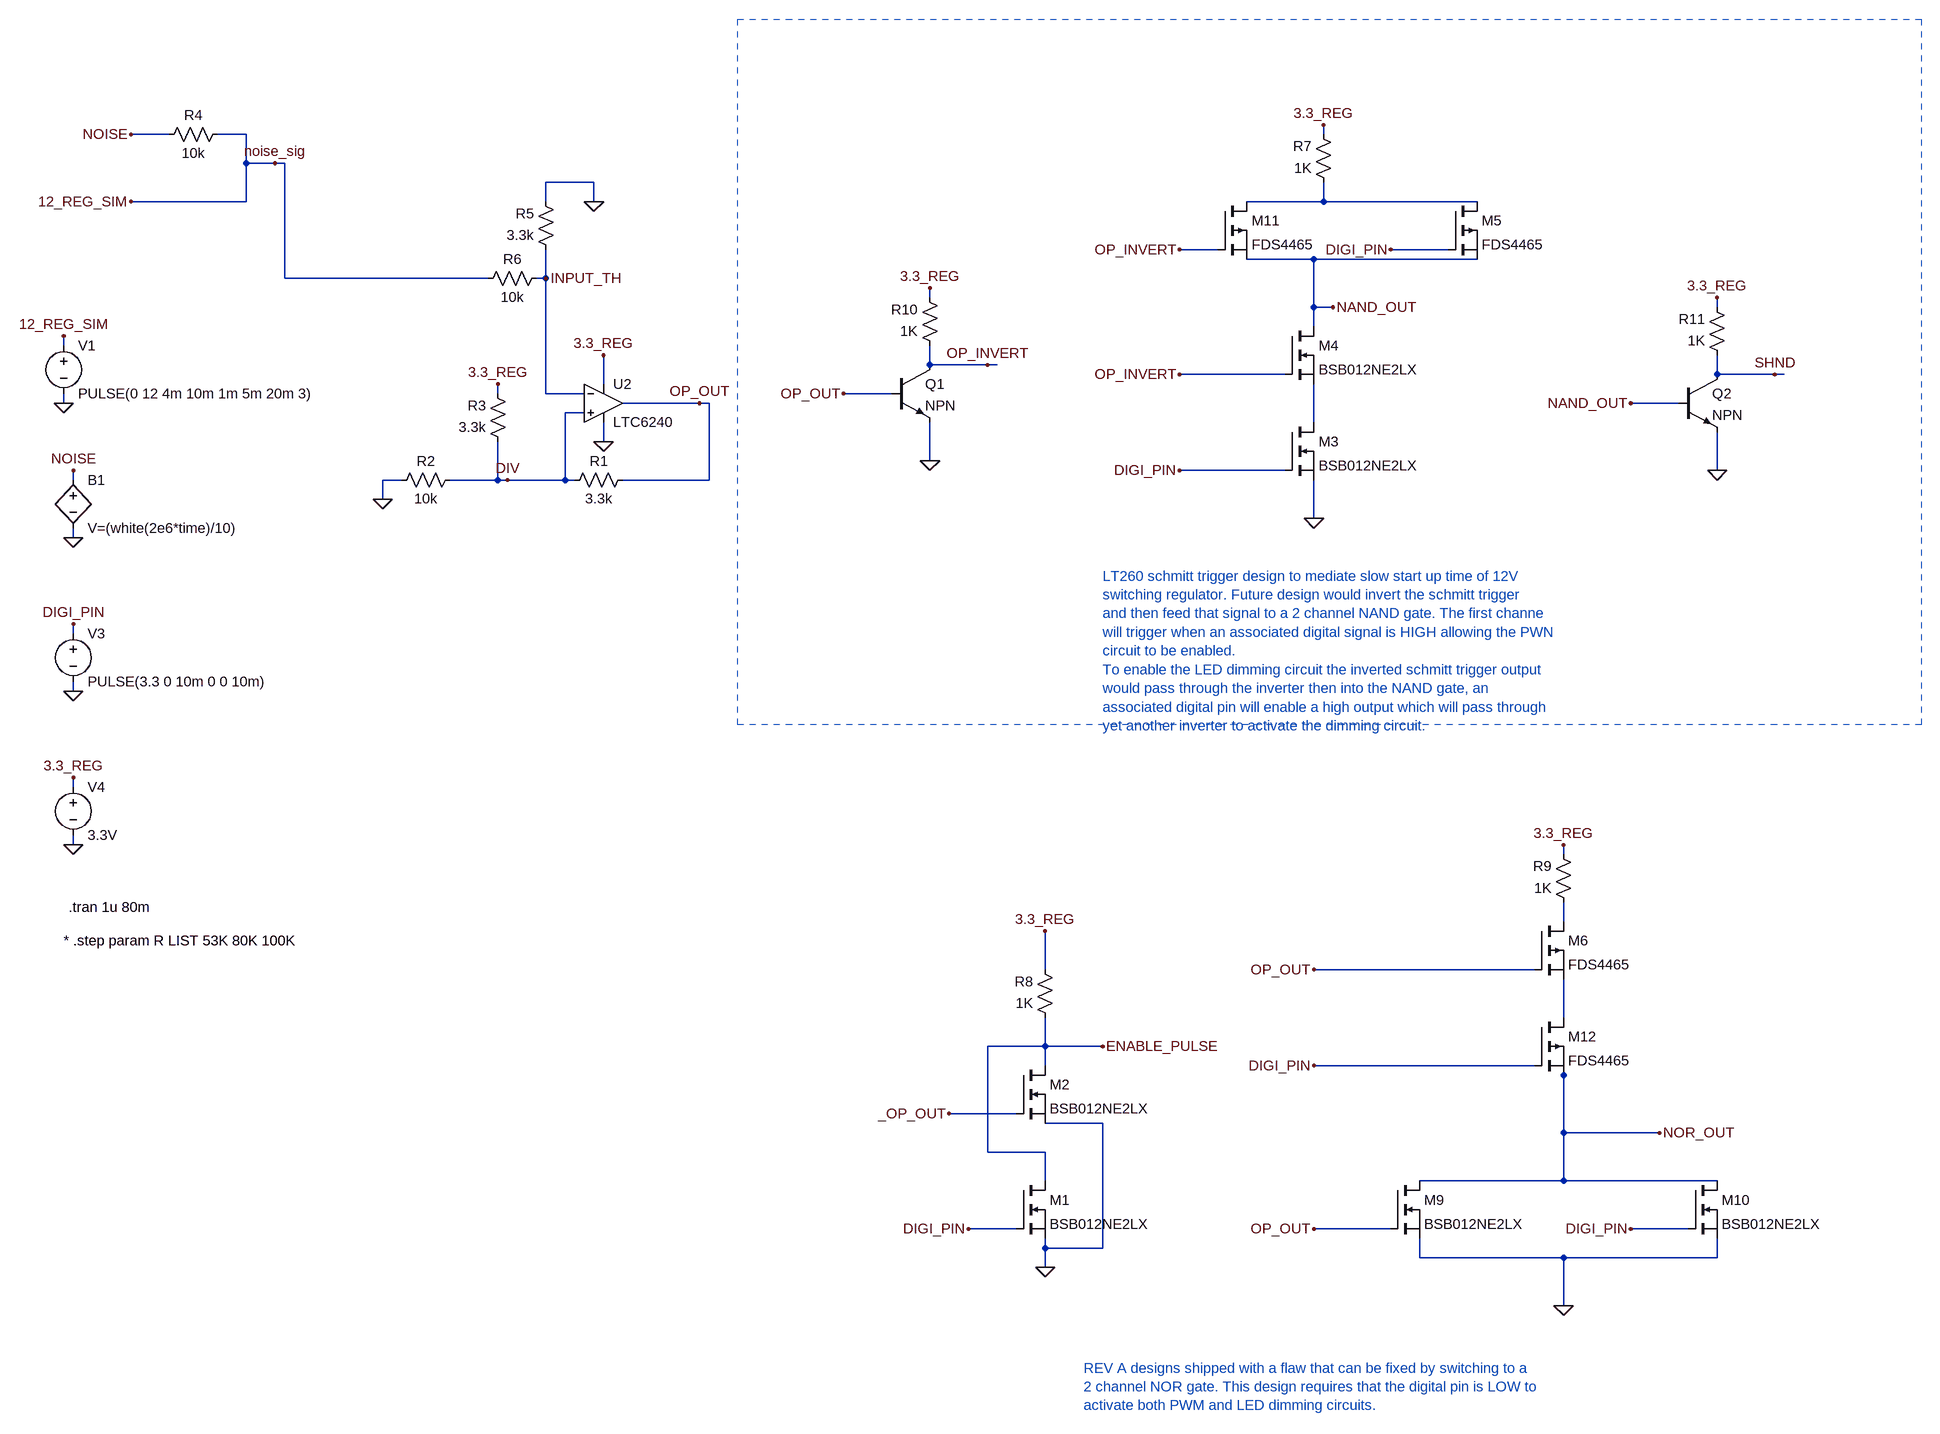
[diagram p0: schematic LT6240_positive_feedback.asc]
LT6240_positive_feedback.asc, the LTspice schematic file:
Version 4
SHEET 1 3400 2064
WIRE -208 -192 -272 -192
WIRE -80 -192 -128 -192
WIRE 1904 -192 1904 -208
WIRE -80 -144 -80 -192
WIRE -32 -144 -80 -144
WIRE -16 -144 -32 -144
WIRE 688 -112 608 -112
WIRE -80 -80 -80 -144
WIRE -80 -80 -272 -80
WIRE 608 -80 608 -112
WIRE 688 -80 688 -112
WIRE 1904 -80 1904 -112
WIRE 1904 -80 1776 -80
WIRE 2160 -80 1904 -80
WIRE 1728 0 1664 0
WIRE 2112 0 2016 0
WIRE 1888 16 1776 16
WIRE 2160 16 1888 16
WIRE -16 48 -16 -144
WIRE 512 48 -16 48
WIRE 608 48 608 0
WIRE 608 48 592 48
WIRE 1248 80 1248 64
WIRE 1888 96 1888 16
WIRE 1920 96 1888 96
WIRE 2560 96 2560 80
WIRE 1888 128 1888 96
WIRE -384 160 -384 144
WIRE 1248 192 1248 160
WIRE 1344 192 1248 192
WIRE 1360 192 1344 192
WIRE 1840 208 1664 208
WIRE 2560 208 2560 176
WIRE 2656 208 2560 208
WIRE 2672 208 2656 208
WIRE 704 224 704 176
WIRE 528 240 528 224
WIRE 608 240 608 48
WIRE 672 240 608 240
WIRE 1184 240 1104 240
WIRE -384 256 -384 240
WIRE 864 256 736 256
WIRE 880 256 864 256
WIRE 2496 256 2416 256
WIRE 672 272 640 272
WIRE 1888 288 1888 224
WIRE 704 320 704 288
WIRE 1248 352 1248 288
WIRE 1840 368 1664 368
WIRE 2560 368 2560 304
WIRE -368 384 -368 368
WIRE 368 384 336 384
WIRE 528 384 528 320
WIRE 528 384 448 384
WIRE 544 384 528 384
WIRE 640 384 640 272
WIRE 640 384 544 384
WIRE 656 384 640 384
WIRE 880 384 880 256
WIRE 880 384 736 384
WIRE 336 416 336 384
WIRE 1888 448 1888 384
WIRE -368 480 -368 464
WIRE -368 640 -368 624
WIRE -368 736 -368 720
WIRE -368 896 -368 880
WIRE -368 992 -368 976
WIRE 2304 1008 2304 992
WIRE 2304 1120 2304 1088
WIRE 1440 1200 1440 1136
WIRE 2256 1200 1888 1200
WIRE 2304 1280 2304 1216
WIRE 1440 1328 1440 1280
WIRE 1440 1328 1344 1328
WIRE 1536 1328 1440 1328
WIRE 1440 1360 1440 1328
WIRE 2256 1360 1888 1360
WIRE 2304 1376 2304 1360
WIRE 1392 1440 1280 1440
WIRE 1536 1456 1440 1456
WIRE 2304 1472 2304 1376
WIRE 2464 1472 2304 1472
WIRE 1344 1504 1344 1328
WIRE 1440 1504 1344 1504
WIRE 1440 1552 1440 1504
WIRE 2304 1552 2304 1472
WIRE 2304 1552 2064 1552
WIRE 2560 1552 2304 1552
WIRE 1392 1632 1312 1632
WIRE 2016 1632 1888 1632
WIRE 2512 1632 2416 1632
WIRE 1440 1664 1440 1648
WIRE 1536 1664 1536 1456
WIRE 1536 1664 1440 1664
WIRE 2064 1680 2064 1648
WIRE 2304 1680 2064 1680
WIRE 2560 1680 2560 1648
WIRE 2560 1680 2304 1680
WIRE 1440 1696 1440 1664
WIRE 2304 1760 2304 1680
FLAG -384 256 0
FLAG -384 144 12_REG_SIM
FLAG 704 176 3.3_REG
FLAG 864 256 OP_OUT
FLAG 336 416 0
FLAG -272 -80 12_REG_SIM
FLAG 704 320 0
FLAG -368 480 0
FLAG -368 368 NOISE
FLAG -272 -192 NOISE
FLAG 688 -80 0
FLAG 528 224 3.3_REG
FLAG 1536 1328 ENABLE_PULSE
FLAG -368 736 0
FLAG -368 624 DIGI_PIN
FLAG 1440 1136 3.3_REG
FLAG 1312 1632 DIGI_PIN
FLAG 544 384 DIV
FLAG 608 48 INPUT_TH
FLAG -32 -144 noise_sig
FLAG -368 880 3.3_REG
FLAG -368 992 0
FLAG 1904 -208 3.3_REG
FLAG 1664 0 OP_INVERT
FLAG 1664 208 OP_INVERT
FLAG 1664 368 DIGI_PIN
FLAG 2016 0 DIGI_PIN
FLAG 1440 1696 0
FLAG 1888 448 0
FLAG 1920 96 NAND_OUT
FLAG 2304 992 3.3_REG
FLAG 1888 1632 OP_OUT
FLAG 1888 1200 OP_OUT
FLAG 1888 1360 DIGI_PIN
FLAG 2416 1632 DIGI_PIN
FLAG 2304 1760 0
FLAG 2464 1472 NOR_OUT
FLAG 1248 64 3.3_REG
FLAG 1248 352 0
FLAG 1104 240 OP_OUT
FLAG 1344 192 OP_INVERT
FLAG 1280 1440 _OP_OUT
FLAG 2560 80 3.3_REG
FLAG 2560 368 0
FLAG 2656 208 SHND
FLAG 2416 256 NAND_OUT
SYMBOL voltage -384 144 R0
SYMATTR InstName V1
SYMATTR Value PULSE(0 12 4m 10m 1m 5m 20m 3)
SYMBOL res 752 368 R90
WINDOW 0 0 56 VBottom 2
WINDOW 3 32 56 VTop 2
SYMATTR InstName R1
SYMATTR Value 3.3k
SYMBOL res 464 368 R90
WINDOW 0 0 56 VBottom 2
WINDOW 3 32 56 VTop 2
SYMATTR InstName R2
SYMATTR Value 10k
SYMBOL bv -368 368 R0
SYMATTR InstName B1
SYMATTR Value V=(white(2e6*time)/10)
SYMBOL res 544 336 R180
WINDOW 0 36 76 Left 2
WINDOW 3 36 40 Left 2
SYMATTR InstName R3
SYMATTR Value 3.3k
SYMBOL res 608 32 R90
WINDOW 0 0 56 VBottom 2
WINDOW 3 32 56 VTop 2
SYMATTR InstName R6
SYMATTR Value 10k
SYMBOL res 624 16 R180
WINDOW 0 36 76 Left 2
WINDOW 3 36 40 Left 2
SYMATTR InstName R5
SYMATTR Value 3.3k
SYMBOL res 1456 1296 R180
WINDOW 0 36 76 Left 2
WINDOW 3 36 40 Left 2
SYMATTR InstName R8
SYMATTR Value 1K
SYMBOL voltage -368 624 R0
SYMATTR InstName V3
SYMATTR Value PULSE(3.3 0 10m 0 0 10m)
SYMBOL nmos 1392 1360 R0
SYMATTR InstName M2
SYMATTR Value BSB012NE2LX
SYMBOL nmos 1392 1552 R0
SYMATTR InstName M1
SYMATTR Value BSB012NE2LX
SYMBOL Opamps/LTC6240 704 256 R0
SYMATTR InstName U2
SYMBOL res -112 -208 R90
WINDOW 0 0 56 VBottom 2
WINDOW 3 32 56 VTop 2
SYMATTR InstName R4
SYMATTR Value 10k
SYMBOL voltage -368 880 R0
SYMATTR InstName V4
SYMATTR Value 3.3V
SYMBOL nmos 1840 288 R0
SYMATTR InstName M3
SYMATTR Value BSB012NE2LX
SYMBOL nmos 1840 128 R0
SYMATTR InstName M4
SYMATTR Value BSB012NE2LX
SYMBOL nmos 2016 1552 R0
SYMATTR InstName M9
SYMATTR Value BSB012NE2LX
SYMBOL nmos 2512 1552 R0
SYMATTR InstName M10
SYMATTR Value BSB012NE2LX
SYMBOL res 1920 -96 R180
WINDOW 0 36 76 Left 2
WINDOW 3 36 40 Left 2
SYMATTR InstName R7
SYMATTR Value 1K
SYMBOL res 2320 1104 R180
WINDOW 0 36 76 Left 2
WINDOW 3 36 40 Left 2
SYMATTR InstName R9
SYMATTR Value 1K
SYMBOL pmos 1728 -80 R0
SYMATTR InstName M11
SYMATTR Value FDS4465
SYMBOL pmos 2112 -80 R0
SYMATTR InstName M5
SYMATTR Value FDS4465
SYMBOL pmos 2256 1120 R0
SYMATTR InstName M6
SYMATTR Value FDS4465
SYMBOL pmos 2256 1280 R0
SYMATTR InstName M12
SYMATTR Value FDS4465
SYMBOL npn 1184 192 R0
SYMATTR InstName Q1
SYMBOL res 1264 176 R180
WINDOW 0 36 76 Left 2
WINDOW 3 36 40 Left 2
SYMATTR InstName R10
SYMATTR Value 1K
SYMBOL npn 2496 208 R0
SYMATTR InstName Q2
SYMBOL res 2576 192 R180
WINDOW 0 36 76 Left 2
WINDOW 3 36 40 Left 2
SYMATTR InstName R11
SYMATTR Value 1K
TEXT -376 1096 Left 2 !.tran 1u 80m
TEXT -384 1152 Left 2 !* .step param R LIST 53K 80K 100K
TEXT 1536 544 Left 2 ;LT260 schmitt trigger design to mediate slow start up time of 12V \nswitching regulator. Future design would invert the schmitt trigger \nand then feed that signal to a 2 channel NAND gate. The first channe \nwill trigger when an associated digital signal is HIGH allowing the PWN \ncircuit to be enabled.\nTo enable the LED dimming circuit the inverted schmitt trigger output \nwould pass through the inverter then into the NAND gate, an \nassociated digital pin will enable a high output which will pass through \nyet another inverter to activate the dimming circuit.
TEXT 1504 1864 Left 2 ;REV A designs shipped with a flaw that can be fixed by switching to a \n2 channel NOR gate. This design requires that the digital pin is LOW to \nactivate both PWM and LED dimming circuits.
RECTANGLE Normal 928 -384 2900 792 2

The netlist it stands for:
* LT6240_positive_feedback.asc
V1 noise_sig 0 PULSE(0 12 4m 10m 1m 5m 20m 3)
R1 OP_OUT DIV 3.3k
R2 DIV 0 10k
B1 NOISE 0 V=(white(2e6*time)/10)
R3 DIV 3.3_REG 3.3k
R6 INPUT_TH noise_sig 10k
R5 INPUT_TH 0 3.3k
R8 ENABLE_PULSE 3.3_REG 1K
V3 DIGI_PIN 0 PULSE(3.3 0 10m 0 0 10m)
M2 ENABLE_PULSE _OP_OUT 0 0 BSB012NE2LX
M1 ENABLE_PULSE DIGI_PIN 0 0 BSB012NE2LX
* U2: LTC6240 (symbol Opamps/LTC6240 not available, pins judged from their places): In+=DIV In-=INPUT_TH V+=3.3_REG V-=0 OUT=OP_OUT
R4 noise_sig NOISE 10k
V4 3.3_REG 0 3.3V
M3 N002 DIGI_PIN 0 0 BSB012NE2LX
M4 NAND_OUT OP_INVERT N002 N002 BSB012NE2LX
M9 NOR_OUT OP_OUT 0 0 BSB012NE2LX
M10 NOR_OUT DIGI_PIN 0 0 BSB012NE2LX
R7 N001 3.3_REG 1K
R9 N003 3.3_REG 1K
M11 N001 OP_INVERT NAND_OUT NAND_OUT FDS4465
M5 N001 DIGI_PIN NAND_OUT NAND_OUT FDS4465
M6 N003 OP_OUT N004 N004 FDS4465
M12 N004 DIGI_PIN NOR_OUT NOR_OUT FDS4465
Q1 OP_INVERT OP_OUT 0 0 NPN
R10 OP_INVERT 3.3_REG 1K
Q2 SHND NAND_OUT 0 0 NPN
R11 SHND 3.3_REG 1K
.model NPN NPN
.model PNP PNP
.lib standard.bjt
.model NMOS NMOS
.model PMOS PMOS
.lib standard.mos
.tran 1u 80m
* .step param R LIST 53K 80K 100K
* LT260 schmitt trigger design to mediate slow start up time of 12V
* switching regulator. Future design would invert the schmitt trigger
* and then feed that signal to a 2 channel NAND gate. The first channe
* will trigger when an associated digital signal is HIGH allowing the PWN
* circuit to be enabled.
* To enable the LED dimming circuit the inverted schmitt trigger output
* would pass through the inverter then into the NAND gate, an
* associated digital pin will enable a high output which will pass through
* yet another inverter to activate the dimming circuit.
* REV A designs shipped with a flaw that can be fixed by switching to a
* 2 channel NOR gate. This design requires that the digital pin is LOW to
* activate both PWM and LED dimming circuits.
.backanno
.end